# Altium schematic sheet Controller Board Interface.SchDoc
size Letter; Organization: Midnight Sun Solar Rayce Car Team; Address1: University of Waterloo; Address2: 200 University Ave W; Address3: Waterloo, ON, Canada; Address4: N2L 3E9; Website: www.uwmidsun.com
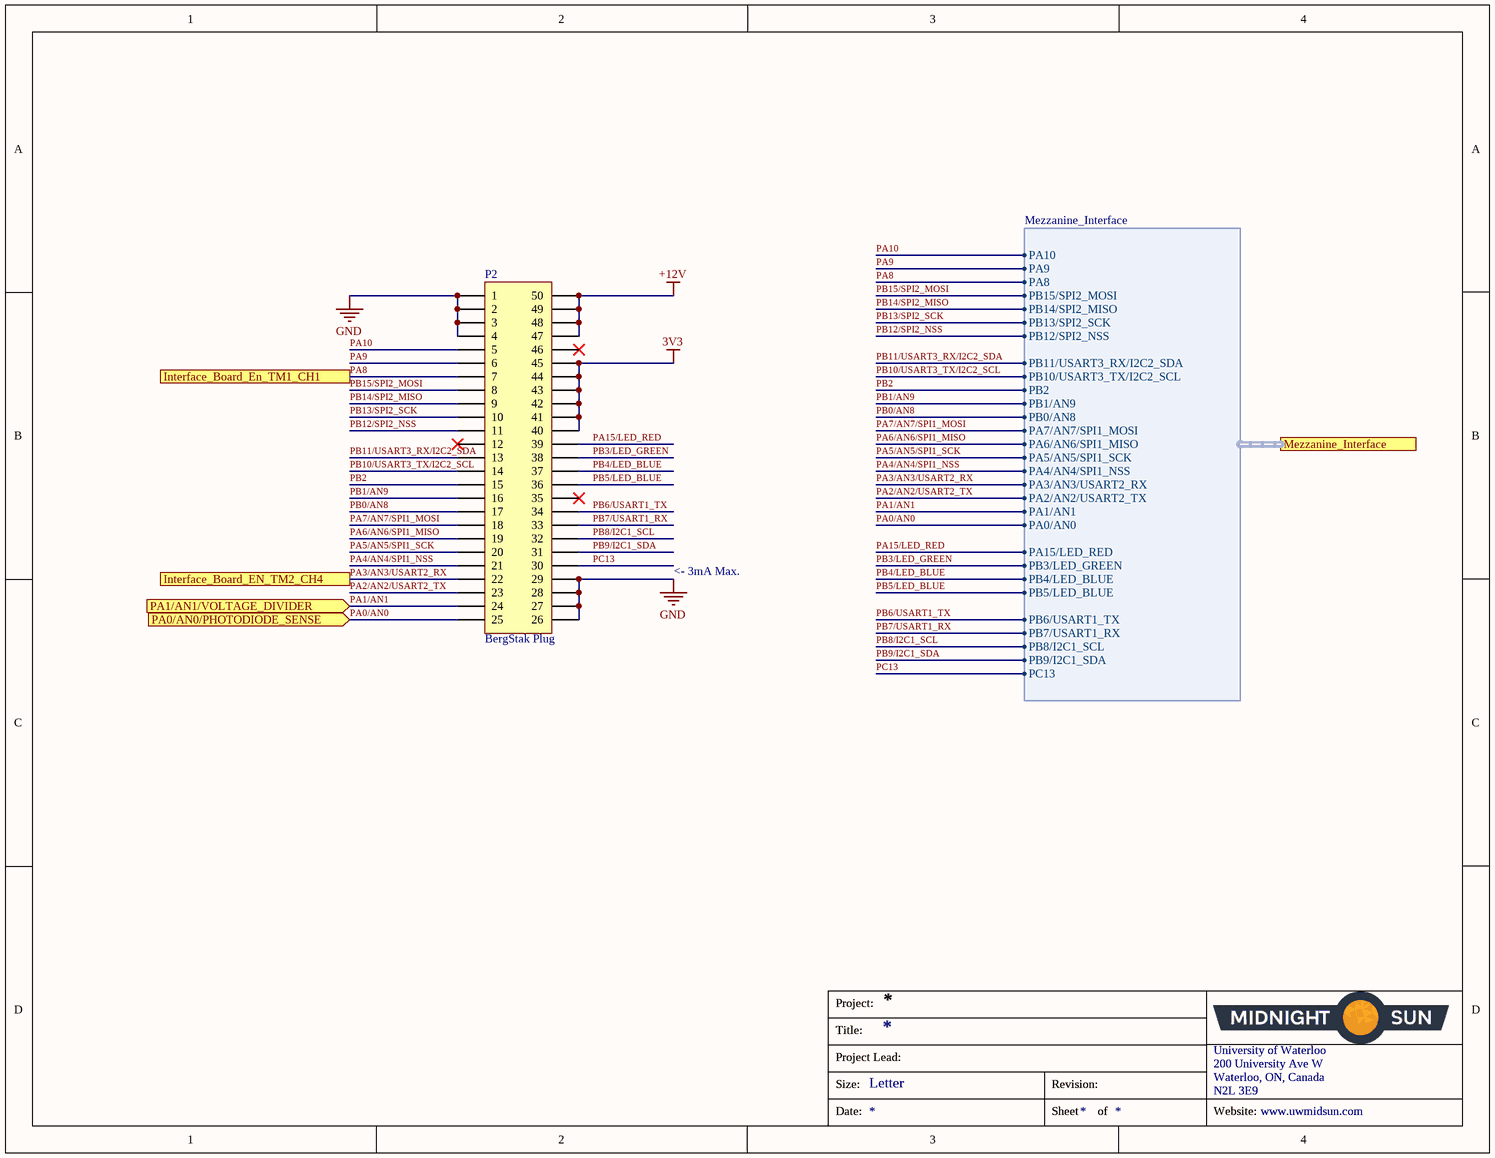
[diagram p0: Controller Board Interface.SchDoc]

## Parts
P2  Series: BergStak Plug  [CONN, Bergstak 50 Pos Plug]  (hidden comment: CONN 50POS Bergstak Plug 0.02")

## Ports
Interface_Board_En_TM1_CH1, Interface_Board_EN_TM2_CH4, Mezzanine_Interface (harness Mezzanine_Interface), PA0/AN0/PHOTODIODE_SENSE (in), PA1/AN1/VOLTAGE_DIVIDER (in)

## Harnesses
Mezzanine_Interface: PA10, PA9, PA8, PB15/SPI2_MOSI, PB14/SPI2_MISO, PB13/SPI2_SCK, PB12/SPI2_NSS, PB11/USART3_RX/I2C2_SDA, PB10/USART3_TX/I2C2_SCL, PB2, PB1/AN9, PB0/AN8, PA7/AN7/SPI1_MOSI, PA6/AN6/SPI1_MISO, PA5/AN5/SPI1_SCK, PA4/AN4/SPI1_NSS, PA3/AN3/USART2_RX, PA2/AN2/USART2_TX, PA1/AN1, PA0/AN0, PA15/LED_RED, PB3/LED_GREEN, PB4/LED_BLUE, PB5/LED_BLUE, PB6/USART1_TX, PB7/USART1_RX, PB8/I2C1_SCL, PB9/I2C1_SDA, PC13

## Nets
3V3: P2.40 P2.41 P2.42 P2.43 P2.44 P2.45
+12V: P2.47 P2.48 P2.49 P2.50
GND: P2.1 P2.2 P2.3 P2.4 P2.26 P2.27 P2.28 P2.29
PA0/AN0: P2.25 ; port PA0/AN0/PHOTODIODE_SENSE, port Mezzanine_Interface.PA0/AN0
PA1/AN1: P2.24 ; port PA1/AN1/VOLTAGE_DIVIDER, port Mezzanine_Interface.PA1/AN1
PA2/AN2/USART2_TX: P2.23 ; port Mezzanine_Interface.PA2/AN2/USART2_TX
PA3/AN3/USART2_RX: P2.22 ; port Interface_Board_EN_TM2_CH4, port Mezzanine_Interface.PA3/AN3/USART2_RX
PA4/AN4/SPI1_NSS: P2.21 ; port Mezzanine_Interface.PA4/AN4/SPI1_NSS
PA5/AN5/SPI1_SCK: P2.20 ; port Mezzanine_Interface.PA5/AN5/SPI1_SCK
PA6/AN6/SPI1_MISO: P2.19 ; port Mezzanine_Interface.PA6/AN6/SPI1_MISO
PA7/AN7/SPI1_MOSI: P2.18 ; port Mezzanine_Interface.PA7/AN7/SPI1_MOSI
PA8: P2.7 ; port Interface_Board_En_TM1_CH1, port Mezzanine_Interface.PA8
PA9: P2.6 ; port Mezzanine_Interface.PA9
PA10: P2.5 ; port Mezzanine_Interface.PA10
PA15/LED_RED: P2.39 ; port Mezzanine_Interface.PA15/LED_RED
PB0/AN8: P2.17 ; port Mezzanine_Interface.PB0/AN8
PB1/AN9: P2.16 ; port Mezzanine_Interface.PB1/AN9
PB2: P2.15 ; port Mezzanine_Interface.PB2
PB3/LED_GREEN: P2.38 ; port Mezzanine_Interface.PB3/LED_GREEN
PB4/LED_BLUE: P2.37 ; port Mezzanine_Interface.PB4/LED_BLUE
PB5/LED_BLUE: P2.36 ; port Mezzanine_Interface.PB5/LED_BLUE
PB6/USART1_TX: P2.34 ; port Mezzanine_Interface.PB6/USART1_TX
PB7/USART1_RX: P2.33 ; port Mezzanine_Interface.PB7/USART1_RX
PB8/I2C1_SCL: P2.32 ; port Mezzanine_Interface.PB8/I2C1_SCL
PB9/I2C1_SDA: P2.31 ; port Mezzanine_Interface.PB9/I2C1_SDA
PB10/USART3_TX/I2C2_SCL: P2.14 ; port Mezzanine_Interface.PB10/USART3_TX/I2C2_SCL
PB11/USART3_RX/I2C2_SDA: P2.13 ; port Mezzanine_Interface.PB11/USART3_RX/I2C2_SDA
PB12/SPI2_NSS: P2.11 ; port Mezzanine_Interface.PB12/SPI2_NSS
PB13/SPI2_SCK: P2.10 ; port Mezzanine_Interface.PB13/SPI2_SCK
PB14/SPI2_MISO: P2.9 ; port Mezzanine_Interface.PB14/SPI2_MISO
PB15/SPI2_MOSI: P2.8 ; port Mezzanine_Interface.PB15/SPI2_MOSI
PC13: P2.30 ; port Mezzanine_Interface.PC13

Not connected (* = marked no-connect by the designer): P2 12* 35* 46*

## Notes on the sheet
- <- 3mA Max.
- Project:
- Title:
- Size:
- Project Lead:
- Letter
- Revision:
- University of Waterloo
- 200 University Ave W
- Waterloo, ON, Canada
- N2L 3E9
- Date:
- Sheet
- of
- Website:

## Library data of the parts
P2 = CONN 50POS Bergstak Plug 0.02": 50 Position Connector Plug, Outer Shroud Contacts Surface Mount Gold; Manufacturer 1: Amphenol FCI; Manufacturer Part Number 1: 10132797-055100LF; Number of Positions: 50; Mated Stacking Heights: 5mm; Pitch: 0.020" (0.50mm); Supplier 1: Digi-Key; Supplier Part Number 1: 609-5226-1-ND; Packaging: Cut Tape (CT); Part Status: Active; Connector Type: Plug, Outer Shroud Contacts; Number of Rows: 2; Mounting Type: Surface Mount; Contact Finish: Gold; Contact Finish Thickness: 1µin (0.025µm); Height Above Board: 0.169" (4.30mm); ComponentLink1URL: http://portal.fciconnect.com/Comergent//fci/drawing/10132797.pdf; ComponentLink1Description: http://portal.fciconnect.com/Comergent//fci/drawing/10132797.pdf